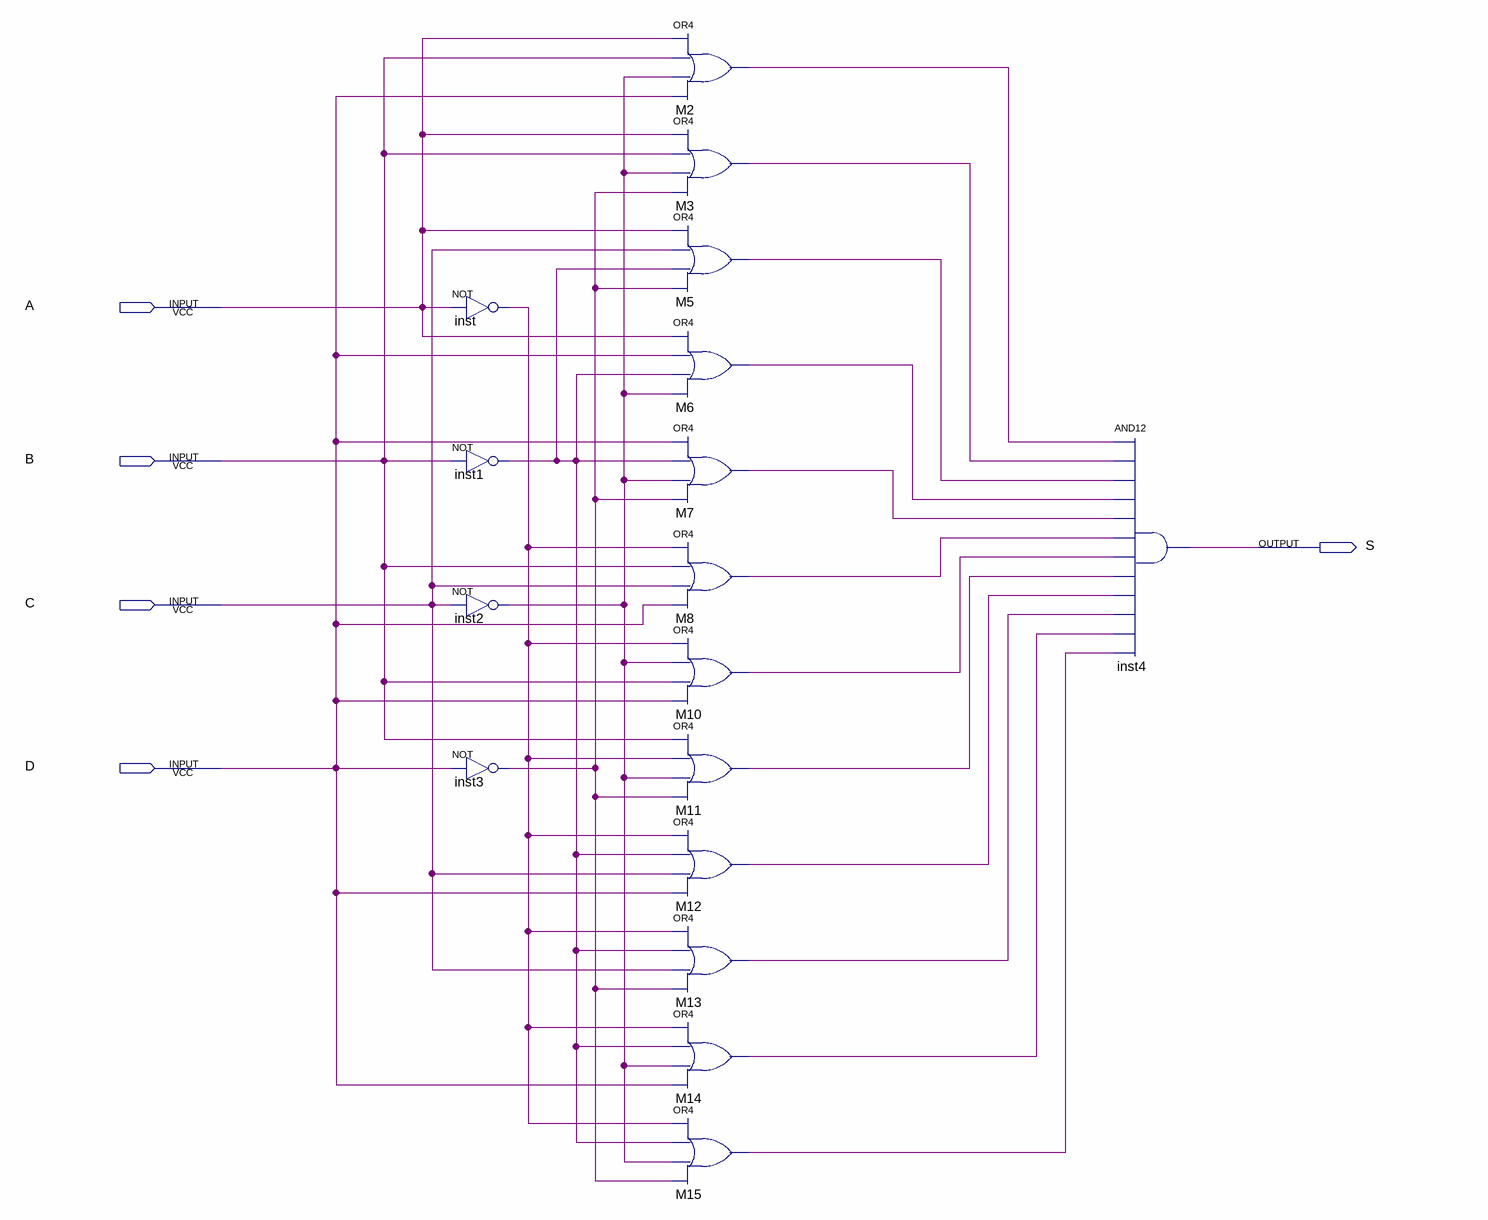
[diagram p0: schematic sheet]
// Quartus schematic S_POS.bdf as structural Verilog: 17 symbols, 5 pins
module S_POS (
  input  A,
  input  B,
  input  C,
  input  D,
  output S
);

  wire inst1_out, inst2_out, inst3_out, inst_out, M2_out, M3_out, M5_out, M6_out, M7_out, M8_out, M10_out,
       M11_out, M12_out, M13_out, M14_out, M15_out;

  not inst (inst_out, A);
  not inst1 (inst1_out, B);
  not inst2 (inst2_out, C);
  not inst3 (inst3_out, D);
  or M2 (M2_out, A, B, inst2_out, D);
  or M3 (M3_out, A, B, inst2_out, inst3_out);
  or M5 (M5_out, A, C, inst1_out, inst3_out);
  or M6 (M6_out, A, D, inst1_out, inst2_out);
  or M7 (M7_out, D, inst1_out, inst2_out, inst3_out);
  or M8 (M8_out, inst_out, B, C, D);
  or M10 (M10_out, inst_out, inst2_out, B, D);
  or M11 (M11_out, B, inst_out, inst2_out, inst3_out);
  or M12 (M12_out, inst_out, inst1_out, C, D);
  or M13 (M13_out, inst_out, inst1_out, C, inst3_out);
  or M14 (M14_out, inst_out, inst1_out, inst2_out, D);
  or M15 (M15_out, inst_out, inst1_out, inst2_out, inst3_out);
  and inst4 (S, M2_out, M3_out, M5_out, M6_out, M7_out, M8_out, M10_out, M11_out, M12_out, M13_out, M14_out, M15_out);
endmodule
